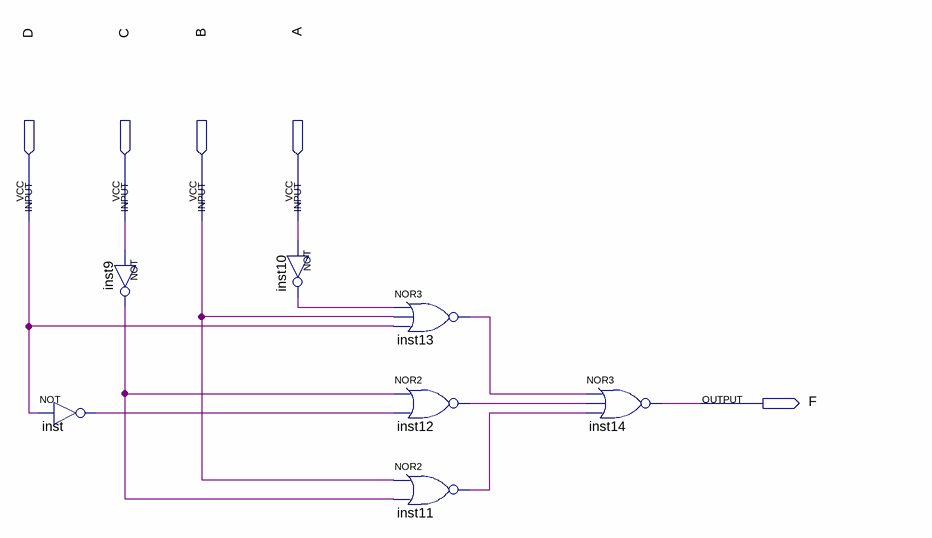
[diagram p0: schematic sheet]
// Quartus schematic dMogan_Bool_3.bdf as structural Verilog: 7 symbols, 5 pins
module dMogan_Bool_3 (
  input  D,
  input  C,
  input  B,
  input  A,
  output F
);

  wire inst9_out, inst10_out, inst11_out, inst12_out, inst13_out, inst_out;

  not inst (inst_out, D);
  not inst9 (inst9_out, C);
  not inst10 (inst10_out, A);
  nor inst13 (inst13_out, inst10_out, B, D);
  nor inst12 (inst12_out, inst9_out, inst_out);
  nor inst11 (inst11_out, B, inst9_out);
  nor inst14 (F, inst13_out, inst12_out, inst11_out);
endmodule
